# EasyEDA schematic schematic.easyeda.json
TITLE: True Binary Alarm Clock with ATTINY85; REV: 1.0; Date: 2017-07-02; Sheet: 1/1; Drawn By: cwilper
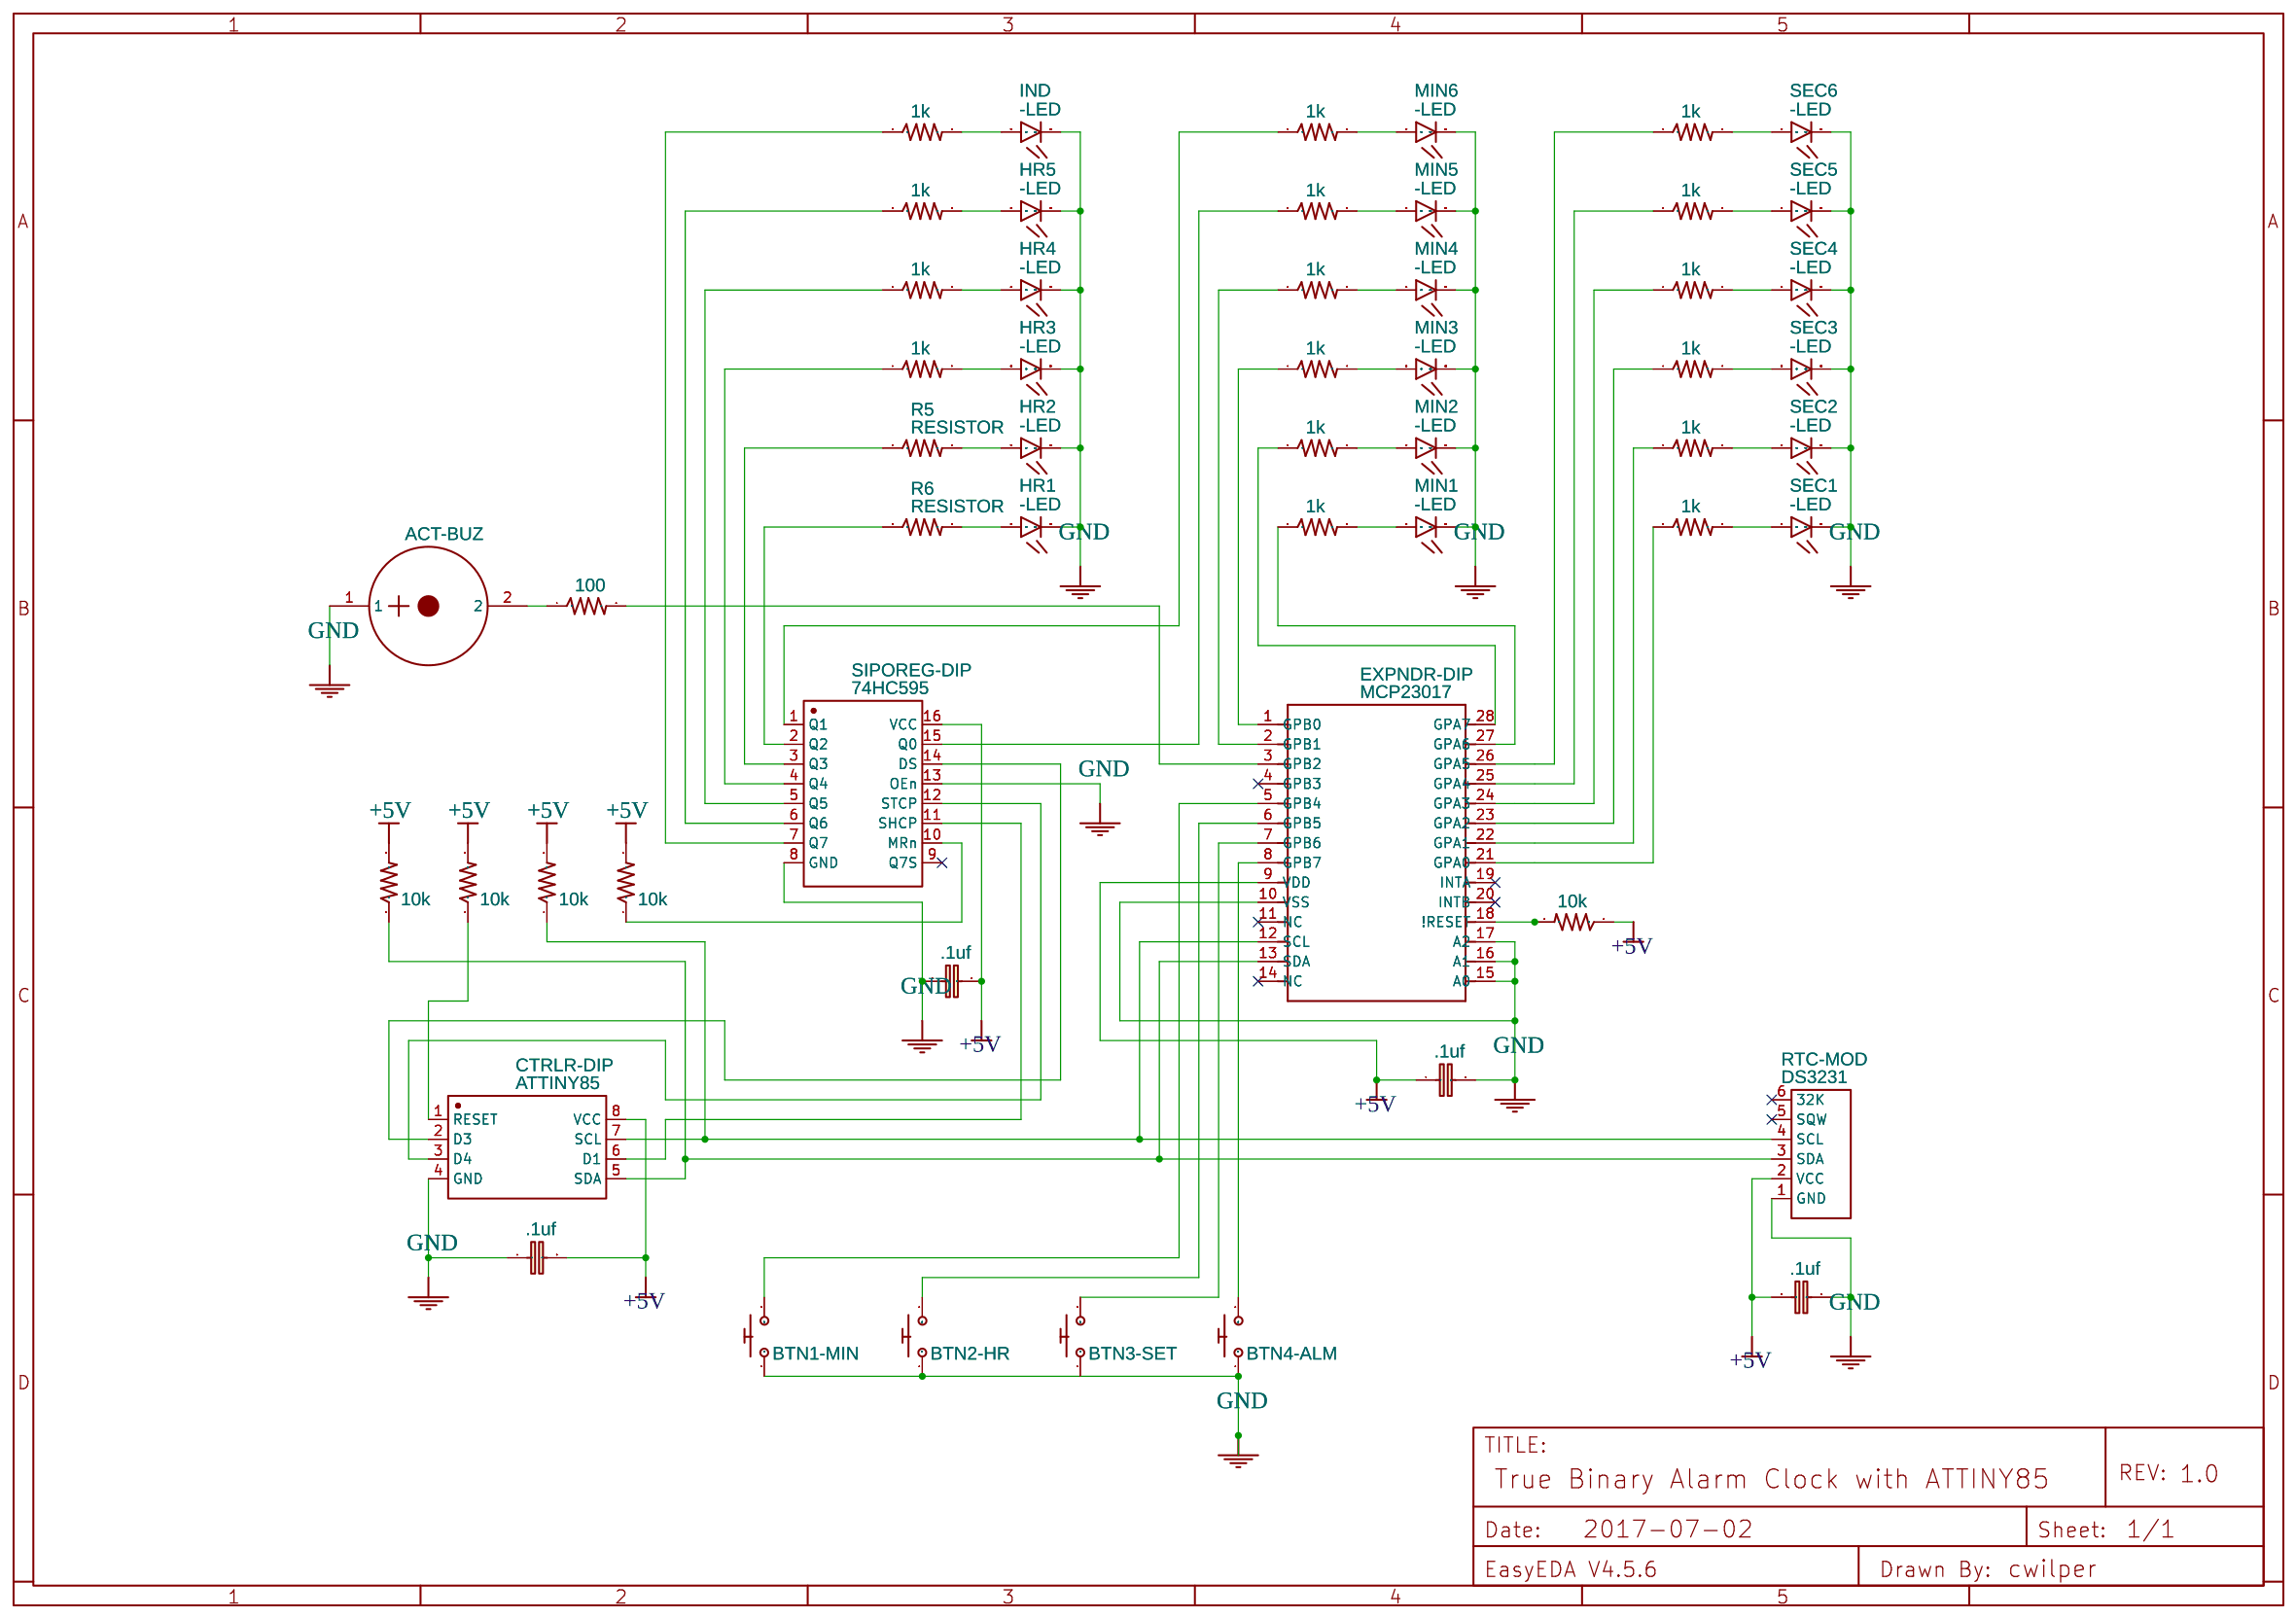
[diagram p0: schematic sheet]

## Parts
BUZ1  ACT-BUZ  [Active Buzzer]
C1  .1uf  [C402]
C2  .1uf  [C402]
C3  .1uf  [C402]
C4  .1uf  [C402]
CTRLR-DIP  ATTINY85  [DIP8]
EXPNDR-DIP  MCP23017  [SOIC28-1.27-17.9X7.5MM]
HR1  -LED  [LED5]
HR2  -LED  [LED5]
HR3  -LED  [LED5]
HR4  -LED  [LED5]
HR5  -LED  [LED5]
IND  -LED  [LED5]
MIN1  -LED  [LED5]
MIN2  -LED  [LED5]
MIN3  -LED  [LED5]
MIN4  -LED  [LED5]
MIN5  -LED  [LED5]
MIN6  -LED  [LED5]
R  100  [1206]
R1  1k  [1206]
R2  1k  [1206]
R3  1k  [1206]
R4  1k  [1206]
R5  RESISTOR  [1206]
R6  RESISTOR  [1206]
R7  1k  [1206]
R8  1k  [1206]
R9  1k  [1206]
R10  1k  [1206]
R11  1k  [1206]
R12  1k  [1206]
R13  1k  [1206]
R14  1k  [1206]
R15  1k  [1206]
R16  1k  [1206]
R17  1k  [1206]
R18  1k  [1206]
R19  10k  [1206]
R20  10k  [1206]
R21  10k  [1206]
R22  10k  [1206]
R23  10k  [1206]
RTC-MOD  DS3231  [HDR-6X1/2.54]
SEC1  -LED  [LED5]
SEC2  -LED  [LED5]
SEC3  -LED  [LED5]
SEC4  -LED  [LED5]
SEC5  -LED  [LED5]
SEC6  -LED  [LED5]
SIPOREG-DIP  74HC595  [DIP16]
SW-1SWITCH  BTN4-ALM  [SMD-BUTTON]
SW-2SWITCH  BTN3-SET  [SMD-BUTTON]
SW-3SWITCH  BTN2-HR  [SMD-BUTTON]
SW-4SWITCH  BTN1-MIN  [SMD-BUTTON]

## Library data of the parts
BUZ1 = -: Manufacturer Part: active buzzer 2300Hz; Contributor: stentz
C1-C4 = -: Non-Polarized capacitor in various packages; catid: 20; Contributor: DangerousPrototype; Manufacturer Part: ?
CTRLR-DIP = -: Manufacturer Part: ?
EXPNDR-DIP = -: DIP IC Interface- I/O EXPANDER I2C 16B; catid: 20; sourceId: fd7pxhfc8; Supplier: SeeedStudio; SeeedStudio: 310070050; Manufacturer Part: MCP23017-E/SO
HR1-HR5 IND MIN1-MIN6 RTC-MOD SEC1-SEC6 = -: catid: 20; Manufacturer Part: ?
R R1-R23 = -: catid: 20; Contributor: SparkFun; Manufacturer Part: ?
SIPOREG-DIP = 74HC595EE: catid: 20; Contributor: example; Manufacturer Part: ?
SW-1SWITCH SW-2SWITCH SW-3SWITCH SW-4SWITCH = -: catid: 20; sourceId: M82WewO60; Supplier: SparkFun; SparkFun: COM-08720; Manufacturer Part: ?

## Nets
+5V: C1.1 C2.2 C3.1 C4.1 CTRLR-DIP.8(VCC) EXPNDR-DIP.9(VDD) R19.2 R20.2 R21.1 R22.2 R23.2 RTC-MOD.2(VCC) SIPOREG-DIP.16(VCC)
GND: BUZ1.1 C1.2 C2.1 C3.2 C4.2 CTRLR-DIP.4(GND) EXPNDR-DIP.10(VSS) EXPNDR-DIP.15(A0) EXPNDR-DIP.16(A1) EXPNDR-DIP.17(A2) HR1.CATHODE HR2.CATHODE HR3.CATHODE HR4.CATHODE HR5.CATHODE IND.CATHODE MIN1.CATHODE MIN2.CATHODE MIN3.CATHODE MIN4.CATHODE MIN5.CATHODE MIN6.CATHODE RTC-MOD.1(GND) SEC1.CATHODE SEC2.CATHODE SEC3.CATHODE SEC4.CATHODE SEC5.CATHODE SEC6.CATHODE SIPOREG-DIP.8(GND) SIPOREG-DIP.13(OEn) SW-1SWITCH.1(P$1) SW-2SWITCH.1(P$1) SW-3SWITCH.1(P$1) SW-4SWITCH.1(P$1)
Net-(BUZ1-2): BUZ1.2 R.1
Net-(CTRLR-DIP-1): CTRLR-DIP.1(RESET) R22.1
Net-(CTRLR-DIP-2): CTRLR-DIP.2(D3) SIPOREG-DIP.14(DS)
Net-(CTRLR-DIP-3): CTRLR-DIP.3(D4) SIPOREG-DIP.12(STCP)
Net-(CTRLR-DIP-5): CTRLR-DIP.5(SDA) EXPNDR-DIP.13(SDA) R20.1 RTC-MOD.3(SDA)
Net-(CTRLR-DIP-6): CTRLR-DIP.6(D1) SIPOREG-DIP.11(SHCP)
Net-(CTRLR-DIP-7): CTRLR-DIP.7(SCL) EXPNDR-DIP.12(SCL) R19.1 RTC-MOD.4(SCL)
Net-(EXPNDR-DIP-1): EXPNDR-DIP.1(GPB0) R10.1
Net-(EXPNDR-DIP-2): EXPNDR-DIP.2(GPB1) R9.1
Net-(EXPNDR-DIP-3): EXPNDR-DIP.3(GPB2) R.2
Net-(EXPNDR-DIP-5): EXPNDR-DIP.5(GPB4) SW-4SWITCH.2(P$2)
Net-(EXPNDR-DIP-6): EXPNDR-DIP.6(GPB5) SW-3SWITCH.2(P$2)
Net-(EXPNDR-DIP-7): EXPNDR-DIP.7(GPB6) SW-2SWITCH.2(P$2)
Net-(EXPNDR-DIP-8): EXPNDR-DIP.8(GPB7) SW-1SWITCH.2(P$2)
Net-(EXPNDR-DIP-18): EXPNDR-DIP.18(!RESET) R21.2
Net-(EXPNDR-DIP-21): EXPNDR-DIP.21(GPA0) R18.1
Net-(EXPNDR-DIP-22): EXPNDR-DIP.22(GPA1) R17.1
Net-(EXPNDR-DIP-23): EXPNDR-DIP.23(GPA2) R16.1
Net-(EXPNDR-DIP-24): EXPNDR-DIP.24(GPA3) R15.1
Net-(EXPNDR-DIP-25): EXPNDR-DIP.25(GPA4) R14.1
Net-(EXPNDR-DIP-26): EXPNDR-DIP.26(GPA5) R13.1
Net-(EXPNDR-DIP-27): EXPNDR-DIP.27(GPA6) R12.1
Net-(EXPNDR-DIP-28): EXPNDR-DIP.28(GPA7) R11.1
Net-(HR1-ANODE): HR1.ANODE R6.2
Net-(HR2-ANODE): HR2.ANODE R5.2
Net-(HR3-ANODE): HR3.ANODE R4.2
Net-(HR4-ANODE): HR4.ANODE R3.2
Net-(HR5-ANODE): HR5.ANODE R2.2
Net-(IND-ANODE): IND.ANODE R1.2
Net-(MIN1-ANODE): MIN1.ANODE R12.2
Net-(MIN2-ANODE): MIN2.ANODE R11.2
Net-(MIN3-ANODE): MIN3.ANODE R10.2
Net-(MIN4-ANODE): MIN4.ANODE R9.2
Net-(MIN5-ANODE): MIN5.ANODE R8.2
Net-(MIN6-ANODE): MIN6.ANODE R7.2
Net-(R1-1): R1.1 SIPOREG-DIP.7(Q7)
Net-(R2-1): R2.1 SIPOREG-DIP.6(Q6)
Net-(R3-1): R3.1 SIPOREG-DIP.5(Q5)
Net-(R4-1): R4.1 SIPOREG-DIP.4(Q4)
Net-(R5-1): R5.1 SIPOREG-DIP.3(Q3)
Net-(R6-1): R6.1 SIPOREG-DIP.2(Q2)
Net-(R7-1): R7.1 SIPOREG-DIP.1(Q1)
Net-(R8-1): R8.1 SIPOREG-DIP.15(Q0)
Net-(R13-2): R13.2 SEC6.ANODE
Net-(R14-2): R14.2 SEC5.ANODE
Net-(R15-2): R15.2 SEC4.ANODE
Net-(R16-2): R16.2 SEC3.ANODE
Net-(R17-2): R17.2 SEC2.ANODE
Net-(R18-2): R18.2 SEC1.ANODE
Net-(R23-1): R23.1 SIPOREG-DIP.10(MRn)

Not connected (* = marked no-connect by the designer): EXPNDR-DIP 4(GPB3)* 11(NC)* 14(NC)* 19(INTA)* 20(INTB)*; RTC-MOD 5(SQW)* 6(32K)*; SIPOREG-DIP 9(Q7S)*
